# EAGLE design SAMD21_GW_M0-MINI-1591_V04 (EAGLE 8.5.1)
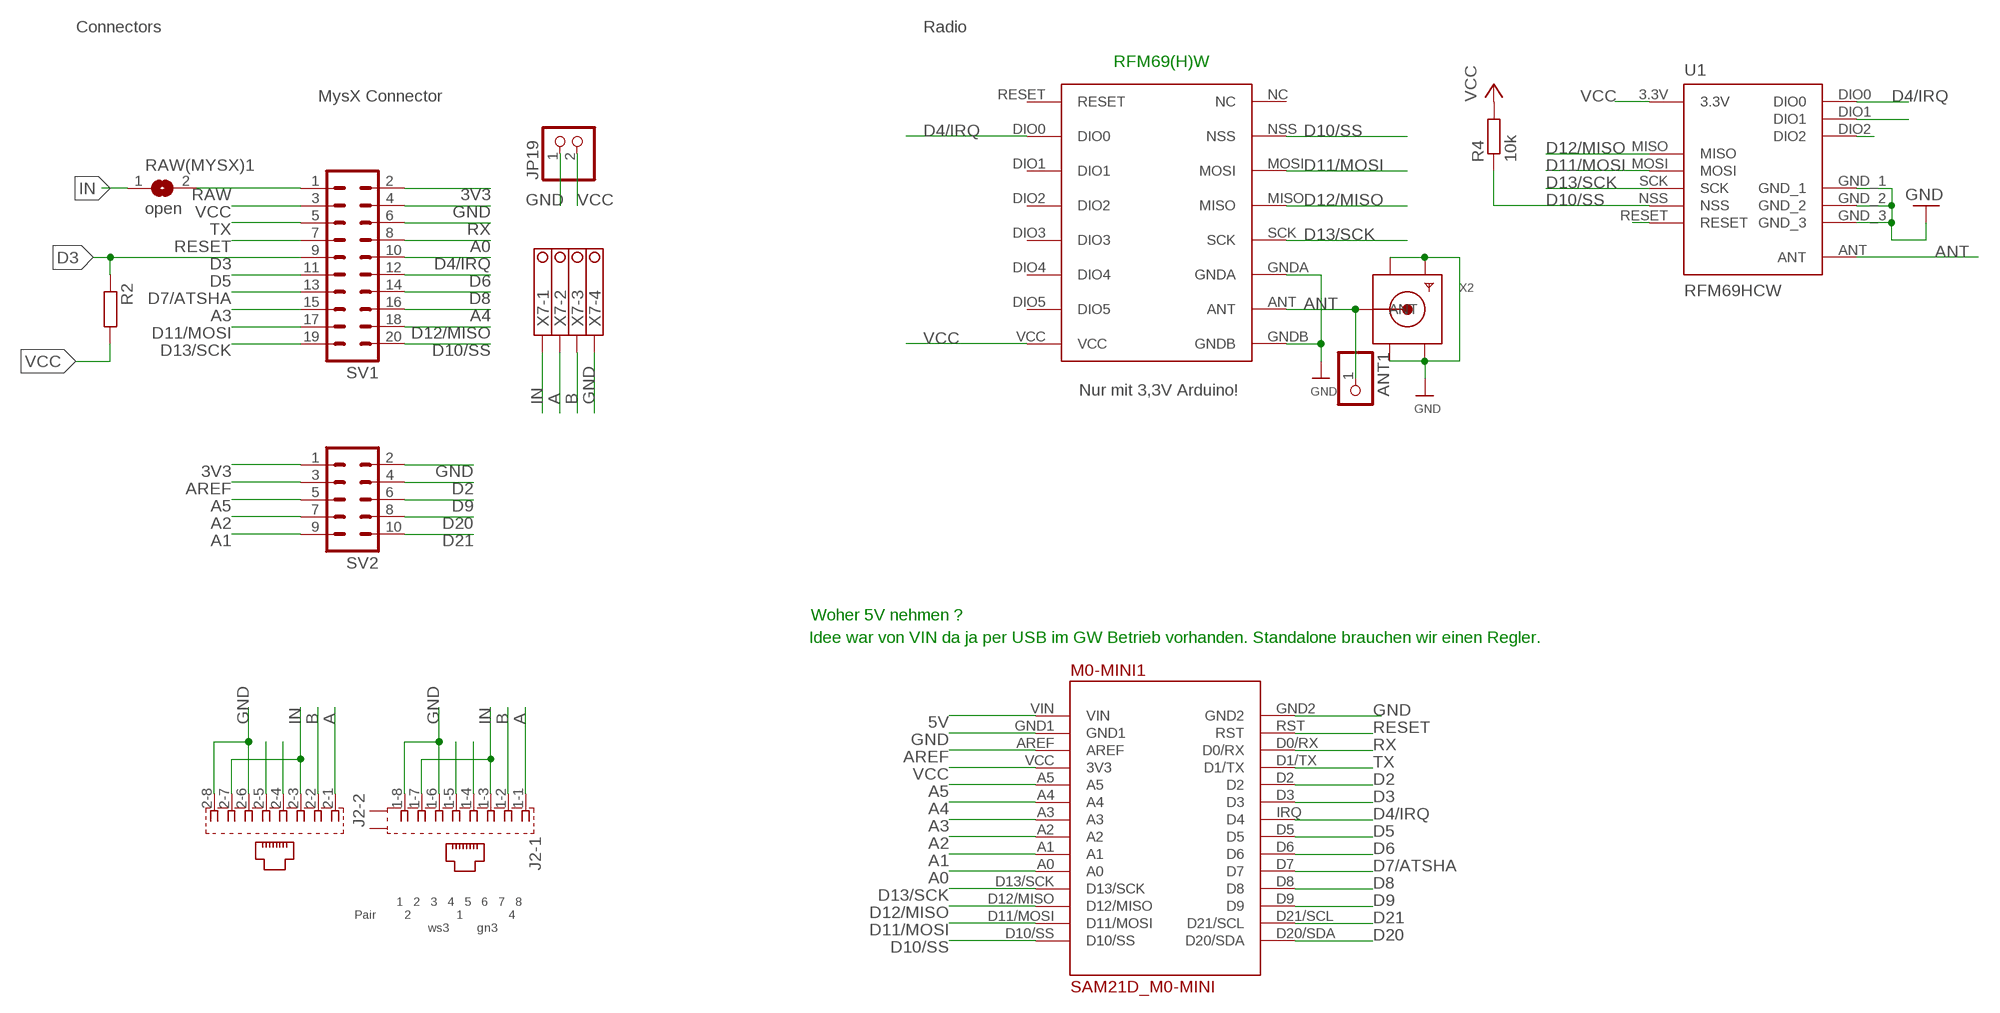
[diagram p0: schematic, sheet 1, part 1 of 2]
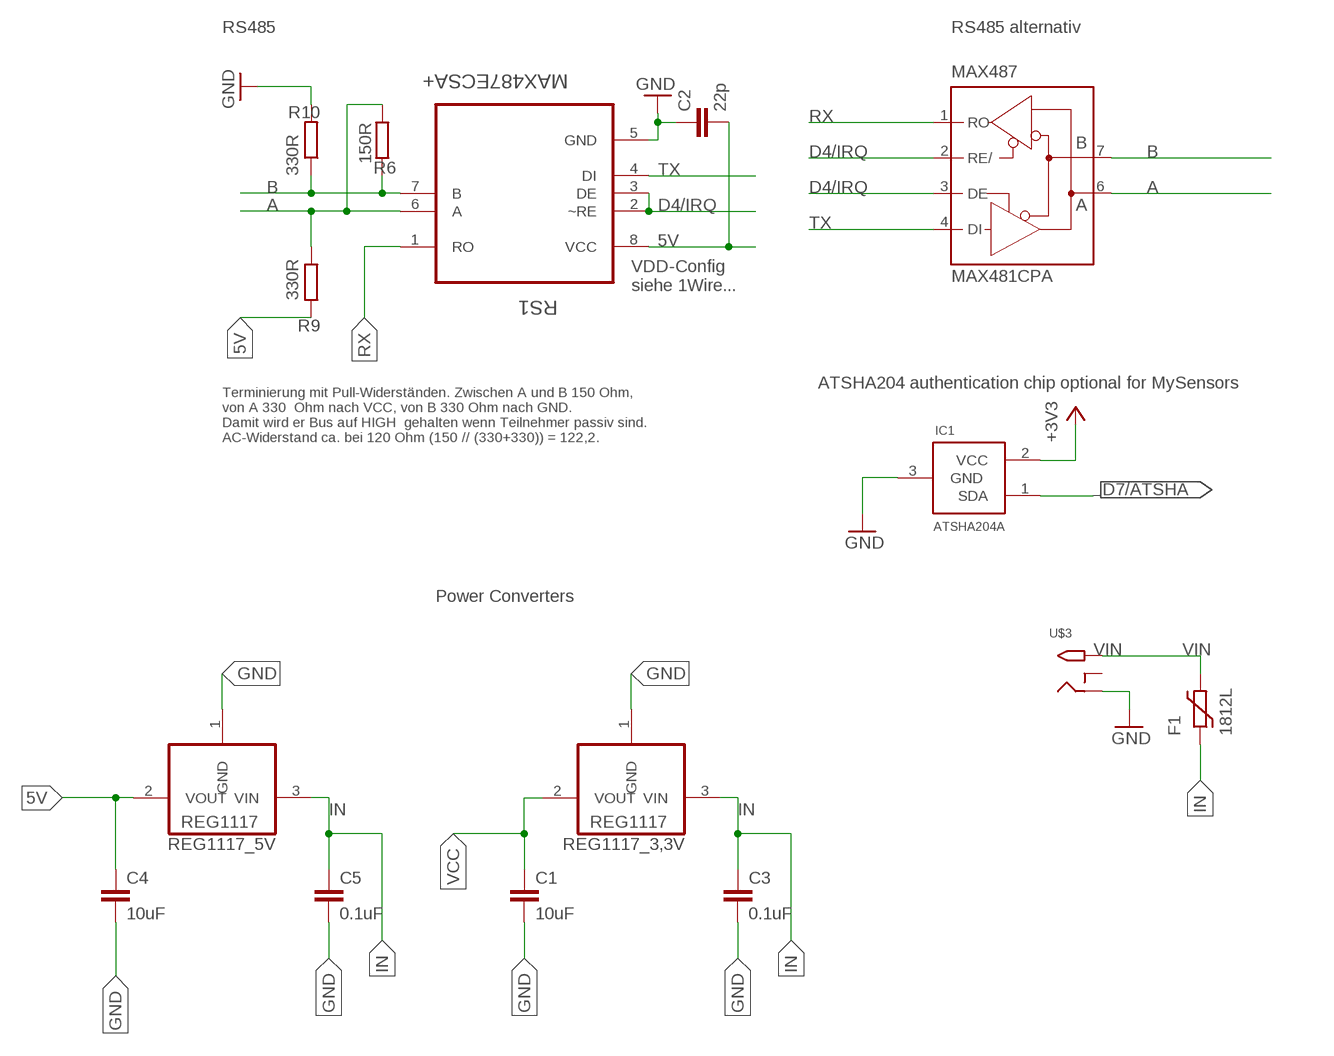
[diagram p1: schematic, sheet 1, part 2 of 2]

## Parts
ANT1  PINHD-1X1  [1X01]
C1  10uF  C-EUC1210  [C1210]
C2  22p  C-EUC0805  [C0805]
C3  0.1uF  C-EUC1206  [C1206]
C4  10uF  C-EUC1210  [C1210]
C5  0.1uF  C-EUC1206  [C1206]
F1  1812L  [1812L]
IC1  ATSHA204A  [SOT23]
J2  557570-1  [557570-1]
JP19  PINHD-1X2  [1X02]
M0-MINI1  SAM21D_M0-MINI  [SAMD21_M0-MINI]
MAX487  MAX481CPA  [DIL08]
R2  R-EU_R0805  [R0805]
R4  10k  R-EU_M0805  [M0805]
R6  150R  R-EU_R0805  [R0805]
R9  330R  R-EU_R0805  [R0805]
R10  330R  R-EU_R0805  [R0805]
RAW(MYSX)1  open  SJ  [SJ]
REG1117_3,3V  REG1117  [SOT223]
REG1117_5V  REG1117  [SOT223]
RFM69W  RFM69HW  [RFM]
RS1  MAX487ECSA+  [SOIC127P600X175-8N]
SV1  MA10-2  [MA10-2]
SV2  MA05-2  [MA05-2]
U1  RFM69HCW  [RFM69HCW-XXXS2]
U$3  2.1MMJACKTHM  [PJ-102A]
X2  SMACONNECTOR_EDGE  [SMA_EDGELAUNCH]
X7  1751264  [1751264]

## Nets
3V3: SV1.2 SV2.1
5V: C2.2 C4.1 M0-MINI1.VIN R9.1 REG1117_5V.2(VOUT) RS1.8(VCC)
A: J2.1-1 J2.2-1 MAX487.6(A) R6.1 R9.2 RS1.6(A) X7.2
A0: M0-MINI1.A0 SV1.8
A1: M0-MINI1.A1 SV2.9
A2: M0-MINI1.A2 SV2.7
A3: M0-MINI1.A3 SV1.15
A4: M0-MINI1.A4 SV1.16
A5: M0-MINI1.A5 SV2.5
ANT: ANT1.1 RFM69W.ANT U1.ANT X2.P(ANT)
AREF: M0-MINI1.AREF SV2.3
B: J2.1-2 J2.2-2 MAX487.7(B) R6.2 R10.1 RS1.7(B) X7.3
D2 [PWR]: M0-MINI1.D2 SV2.4
D3: M0-MINI1.D3 R2.1 SV1.9
D4/IRQ: M0-MINI1.IRQ(D4) RFM69W.DIO0 RS1.2(~RE) RS1.3(DE) SV1.10 U1.DIO0
D5: M0-MINI1.D5 SV1.11
D6: M0-MINI1.D6 SV1.12
D7/ATSHA: IC1.1(SDA) M0-MINI1.D7 SV1.13
D8: M0-MINI1.D8 SV1.14
D9: M0-MINI1.D9 SV2.6
D10/SS: M0-MINI1.D10/SS R4.1 RFM69W.NSS SV1.20 U1.NSS
D11/MOSI: M0-MINI1.D11/MOSI RFM69W.MOSI SV1.17 U1.MOSI
D12/MISO: M0-MINI1.D12/MISO RFM69W.MISO SV1.18 U1.MISO
D13/SCK: M0-MINI1.D13/SCK RFM69W.SCK SV1.19 U1.SCK
D20: SV2.8
D21: SV2.10
GND [PWR]: C1.2 C2.1 C3.2 C4.2 C5.2 IC1.3(GND) J2.1-6 J2.1-8 J2.2-6 J2.2-8 JP19.1 M0-MINI1.GND1 M0-MINI1.GND2 R10.2 REG1117_3,3V.1(GND) REG1117_5V.1(GND) RFM69W.GNDA RFM69W.GNDB RS1.5(GND) SV1.4 SV2.2 U1.GND_1 U1.GND_2 U1.GND_3 U$3.RING X2.GND@1(GND4) X2.GND@2(GND3) X2.GND@3(GND2) X2.GND@4(GND1) X7.4
IN [PWR]: C3.1 C5.1 F1.P$1 J2.1-3 J2.1-7 J2.2-3 J2.2-7 RAW(MYSX)1.1 REG1117_3,3V.3(VIN) REG1117_5V.3(VIN) X7.1
N$1: MAX487.2(RE/)
N$2: J2.1-4
N$3: J2.1-5
N$4: MAX487.3(DE)
N$6: J2.2-4
N$7: J2.2-5
N$10: MAX487.1(RO)
N$11: MAX487.4(DI)
N$12: U1.DIO2
N$13: U1.RESET
N$15: U1.DIO1
RAW: RAW(MYSX)1.2 SV1.1
RESET: M0-MINI1.RST SV1.7
RX: M0-MINI1.D0/RX RS1.1(RO) SV1.6
TX: M0-MINI1.D1/TX RS1.4(DI) SV1.5
VCC [PWR]: C1.1 IC1.2(VCC) JP19.2 M0-MINI1.VCC(3V3) R2.2 R4.2 REG1117_3,3V.2(VOUT) RFM69W.VCC SV1.3 U1.3.3V ; supply symbol labelled +3V3
VIN [PWR]: F1.P$2 U$3.TIP
Unconnected: J2.G1(-1:S2) J2.G3(-1:S1) M0-MINI1.D20/SDA M0-MINI1.D21/SCL RFM69W.DIO1 RFM69W.DIO2 RFM69W.DIO3 RFM69W.DIO4 RFM69W.DIO5 RFM69W.NC RFM69W.RESET U$3.RING_SW

## Notes on the sheet
- Connectors | Radio | RS485 | RS485 alternativ
- RFM69(H)W
- MysX Connector
- VDD-Config
  siehe 1Wire...
- ATSHA204 authentication chip optional for MySensors
- Nur mit 3,3V Arduino!
- Terminierung mit Pull-Widerständen. Zwischen A und B 150 Ohm,
  von A 330  Ohm nach VCC, von B 330 Ohm nach GND. 
  Damit wird er Bus auf HIGH  gehalten wenn Teilnehmer passiv sind.
  AC-Widerstand ca. bei 120 Ohm (150 // (330+330)) = 122,2.
- Power Converters
- Woher 5V nehmen ?
- Idee war von VIN da ja per USB im GW Betrieb vorhanden. Standalone brauchen wir einen Regler.
- 1   2   3   4   5   6   7   8
  Pair        2             1             4
                       ws3        gn3

## Power pins joined to a net without a drawn wire
GND: MAX487.5(GND)
VCC: MAX487.8(VCC)

## Library data of the parts
ANT1 = pinhead:PINHD-1X1: PIN HEADER
C1-C5 = rcl:C-EU: CAPACITOR, European symbol; SPICEPREFIX: C
F1 = ptc-littlefuse:1812L
IC1 = Sensor:ATSHA204A
J2 = con-amp:557570-1: AMP connector
JP19 = pinhead:PINHD-1X2: PIN HEADER
M0-MINI1 = SAM21D_M0-MINI_Footprint:SAM21D_M0-MINI: Footprint SAMD21 M0-MINI
MAX487 = maxim-4:MAX481CPA: RS485 TRANSEIVER
R2 R4 R6 R9 R10 = rcl:R-EU_: RESISTOR, European symbol
RAW(MYSX)1 = jumper:SJ: SMD solder JUMPER
REG1117_3,3V REG1117_5V = burr-brown:REG1117: 800mA and 1A Low Dropout (LDO) Positive Regulator 1.8V, 2.5V, 2.85V, 3.3V, 5V, and Adj; MPN: REG1117; OC_FARNELL: 1097566; OC_NEWARK: 14P6981
RFM69W = hoperf:RFM69HW
RS1 = Maxim_By_element14_Batch_1:MAX487ECSA+: Low-Power, Slew-Rate-Limited RS-485/RS-422 Transceivers; MPN: MAX487ECSA+; OC_FARNELL: 9724532; OC_NEWARK: 68K4803; PACKAGE: SOIC-8; SUPPLIER: Maxim
SV1 = con-lstb:MA10-2: PIN HEADER; OC_FARNELL: unknown; OC_NEWARK: unknown
SV2 = con-lstb:MA05-2: PIN HEADER; OC_FARNELL: unknown; OC_NEWARK: unknown
U1 = doug:RFM69H
U$3 = adafruit:2.1MMJACK: 2.1mm x 5.5mm THM DC jack with internal switch. Digikey part #PJ-102A, 4UCON part #05537 2.1mm x 5.5mm SMT DC jack with internal switch. Digikey part #PJ-002A-SMT, 4UCON part #03267 By microbuilder.eu & adafruit.com
X2 = adafruit:SMACONNECTOR: SMA Connector 90° DIP SMA Connector, 50 Ohm (4UConnector: 07259)
X7 = con-phoenix-350:1751264: MKDS 1/ 4-3,5 Printklemme Nennstrom: 10 A Bemessungsspannung: 160 V Raster: 3,5 mm Polzahl: 4 Montageart: Löten Anschlussart: Schraubanschluss Anschlussrichtung vom Leiter zur Platine: 0° Source: http://eshop.phoenixcontact.com .. 1751264.pdf; MPN: 1751264; OC_FARNELL: unknown; OC_NEWARK: 10R0934

## Net classes
0 default: width 0.254 mm
1 PWR: width 0.406 mm

## Board
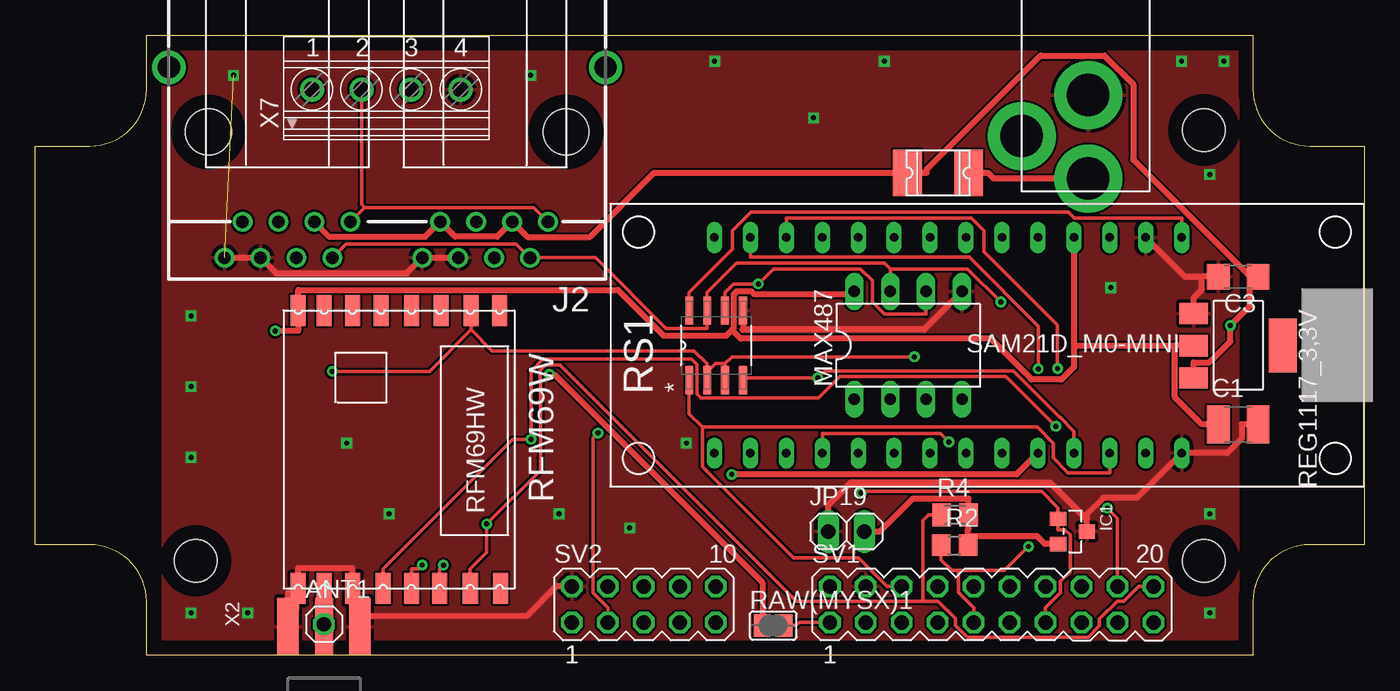
[diagram p2: board, top side]
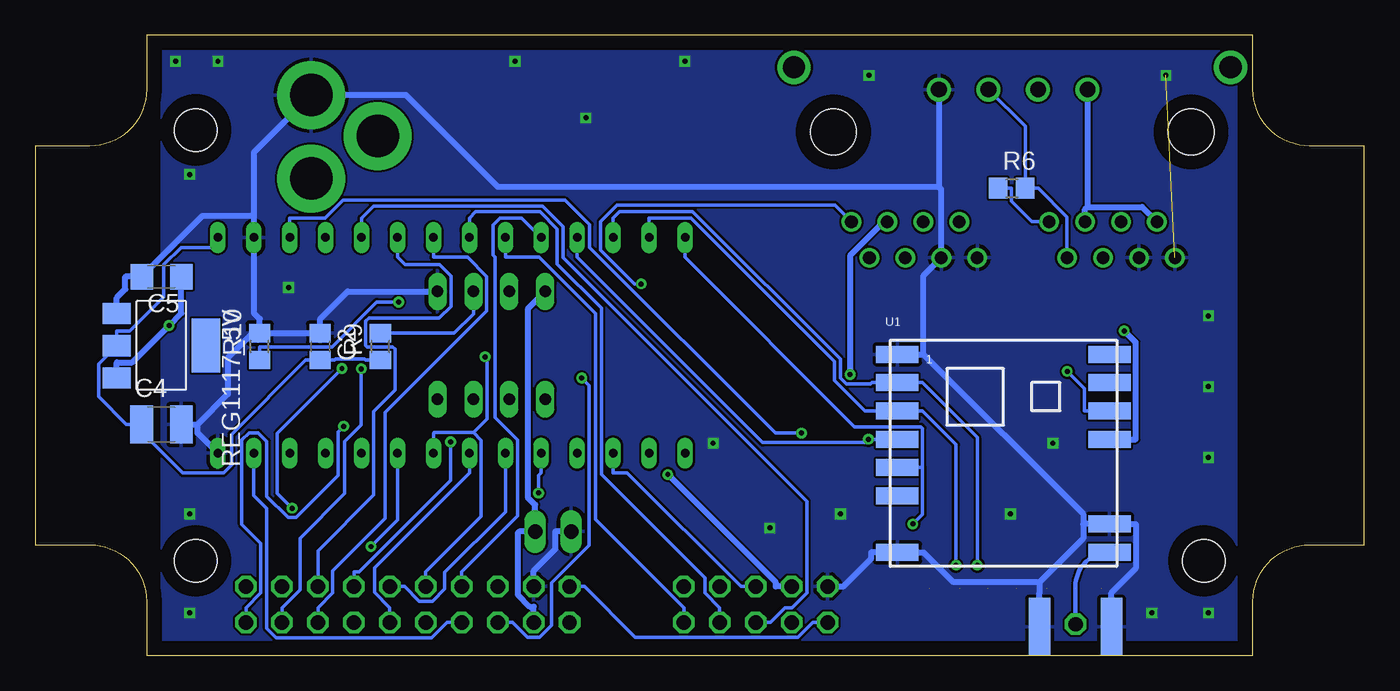
[diagram p3: board, bottom side, seen from below]

Size 93.9 x 43.83 mm. Coordinates in mm from the lower left corner, seen from the top.
Outline: 0,36.02 3.85,36.02 arc90 7.85,40.02 7.85,43.83 86.05,43.83 86.05,40.02 arc90 90.05,36.02 93.9,36.02 93.9,7.82 90.05,7.82 arc90 86.05,3.81 86.05,0 7.85,0 7.85,3.81 arc90 3.85,7.82 0,7.82 0,36.02
Copper layers (1*16): Top 0.035mm / dielectric 1.5mm / Bottom 0.035mm
Design rules "default": minimum track width 6mil, minimum drill 0.35mm, track to track 6mil, track to pad 6mil, pad to pad 6mil, via to via 6mil, smd to smd 6mil, copper to edge 40mil, drill to drill 6mil, minimum pad ring 10mil, minimum via ring 8mil, stop-mask expansion 4mil, vias tented up to drill 0mil, thermal gap 10mil
Holes 3 mm at 11.32,6.69 82.58,6.69 82.58,37.14

### Footprints (pad centres in the part's own frame; a part is rotated, then mirrored left to right if it is on the bottom)
1X01 = drill 1.016 octagon: 1 0,0
C1210 = smd 1.6 x 2.7: 1 -1.4,0; 2 1.4,0
C0805 = smd 1.3 x 1.5: 1 -0.95,0; 2 0.95,0
C1206 = smd 1.6 x 1.8: 1 -1.4,0; 2 1.4,0
1812L = smd 2.03 x 3.3: P$1 -2.16,0; P$2 2.16,0
SOT23 = smd 1.016 x 1.143: 1 -0.889,-1.016; 2 0.889,-1.016; 3 0,1.016
557570-1 = drill 0.889: 1-1 -11.43,6.35; 1-2 -10.16,8.89; 1-3 -8.89,6.35; 1-4 -7.62,8.89; 1-5 -6.35,6.35; 1-6 -5.08,8.89; 1-7 -3.81,6.35; 1-8 -2.54,8.89; 2-1 2.54,6.35; 2-2 3.81,8.89; 2-3 5.08,6.35; 2-4 6.35,8.89; 2-5 7.62,6.35; 2-6 8.89,8.89; 2-7 10.16,6.35; 2-8 11.43,8.89 | drill 1.575 pad 2.184: G1 -15.494,-4.572; G3 15.367,-4.572 | hole 3.251: -12.7,0; 12.573,0
1X02 = drill 1.016 long: 1 -1.27,0; 2 1.27,0
SAMD21_M0-MINI = drill 0.6 long: A0 -7.62,-6.35; A1 -7.62,-3.81; A2 -7.62,-1.27; A3 -7.62,1.27; A4 -7.62,3.81; A5 -7.62,6.35; AREF -7.62,11.43; D0/RX 7.62,11.43; D1/TX 7.62,8.89; D2 7.62,6.35; D3 7.62,3.81; D5 7.62,-1.27; D6 7.62,-3.81; D7 7.62,-6.35; D8 7.62,-8.89; D9 7.62,-11.43; D10/SS -7.62,-16.51; D11/MOSI -7.62,-13.97; D12/MISO -7.62,-11.43; D13/SCK -7.62,-8.89; D20/SDA 7.62,-16.51; D21/SCL 7.62,-13.97; GND1 -7.62,13.97; GND2 7.62,16.51; IRQ 7.62,1.27; RST 7.62,13.97; VCC -7.62,8.89; VIN -7.62,16.51
DIL08 = drill 0.813 long: 1 -3.81,-3.81; 2 -1.27,-3.81; 3 1.27,-3.81; 4 3.81,-3.81; 5 3.81,3.81; 6 1.27,3.81; 7 -1.27,3.81; 8 -3.81,3.81
R0805 = smd 1.3 x 1.5: 1 -0.95,0; 2 0.95,0
M0805 = smd 1.3 x 1.6: 1 -0.95,0; 2 0.95,0
SJ = smd 1.168 x 1.6: 1 -0.762,0; 2 0.762,0
SOT223 = smd 1.499 x 2.007: 1 -2.261,-3.15; 2 0.025,-3.15; 3 2.311,-3.15 | smd 3.81 x 2.007: 4 0,3.15
RFM = smd 2.184 x 1.067: ANT 19.651,2.889; DIO0 0,13.27; DIO1 0,11.143; DIO2 0,9.047; DIO3 0,6.889; DIO4 0,4.889; DIO5 0,2.889; GNDA 19.651,4.889; GNDB 19.651,1.048; MISO 19.651,9.047; MOSI 19.651,11.047; NC 19.651,15.334; NSS 19.651,13.206; RESET 0,15.27; SCK 19.651,7.048; VCC 0,1.048
SOIC127P600X175-8N = smd 1.981 x 0.533: 1 -2.464,1.905; 2 -2.464,0.635; 3 -2.464,-0.635; 4 -2.464,-1.905; 5 2.464,-1.905; 6 2.464,-0.635; 7 2.464,0.635; 8 2.464,1.905
MA10-2 = drill 1.016 octagon: 1 -11.43,-1.27; 2 -11.43,1.27; 3 -8.89,-1.27; 4 -8.89,1.27; 5 -6.35,-1.27; 6 -6.35,1.27; 7 -3.81,-1.27; 8 -3.81,1.27; 9 -1.27,-1.27; 10 -1.27,1.27; 11 1.27,-1.27; 12 1.27,1.27; 13 3.81,-1.27; 14 3.81,1.27; 15 6.35,-1.27; 16 6.35,1.27; 17 8.89,-1.27; 18 8.89,1.27; 19 11.43,-1.27; 20 11.43,1.27
MA05-2 = drill 1.016 octagon: 1 -5.08,-1.27; 2 -5.08,1.27; 3 -2.54,-1.27; 4 -2.54,1.27; 5 0,-1.27; 6 0,1.27; 7 2.54,-1.27; 8 2.54,1.27; 9 5.08,-1.27; 10 5.08,1.27
RFM69HCW-XXXS2 = smd 3 x 1.2: 3.3V 7.5,1; ANT 7.5,-7; DIO0 7.5,3; DIO1 7.5,5; DIO2 7.5,7; GND_1 7.5,-5; GND_2 -7.5,-7; GND_3 -7.5,7; MISO -7.5,5; MOSI -7.5,3; NSS -7.5,-1; RESET -7.5,-3; SCK -7.5,1
PJ-102A = drill 3 pad 4.8: RING 0.1,-3.39; RING_SW -4.6,-6.29; TIP 0.1,-9.29
SMA_EDGELAUNCH = smd 4.064 x 1.524: GND@1 2.032,-2.54; GND@2 2.032,2.54 | smd 4.064 x 1.524 bottom: GND@3 2.032,2.54; GND@4 2.032,-2.54 | smd 4.064 x 1.27: P 2.032,0
1751264 = drill 1.1 pad 1.7: 1 -5.25,-0.1; 2 -1.75,-0.1; 3 1.75,-0.1; 4 5.25,-0.1

### Placement (x,y rotation side)
ANT1  20.4,2.2 0 top
C1  85,16.33 0 top
C2  73.77,21.83 270 bottom
C3  85,26.77 180 top
C4  84.99,16.33 0 bottom
C5  84.98,26.77 180 bottom
F1  63.79,34.11 0 top
IC1  73.29,8.76 270 top
J2  24.8,37 180 top
JP19  57.31,8.76 0 top
M0-MINI1  64.5,21.91 270 top
MAX487  61.68,21.91 0 top
R2  64.96,7.79 0 top
R4  64.99,9.93 0 top
R6  24.9,33.03 0 bottom
R9  69.52,21.83 90 bottom
R10  78.05,21.83 90 bottom
RAW(MYSX)1  52.14,2.11 0 top
REG1117_3,3V  85,21.91 270 top
REG1117_5V  85,21.91 270 bottom
RFM69W  17.53,24.39 270 top
RS1  48.1,21.91 90 top
SV1  67.58,3.6 0 top
SV2  43,3.6 0 top
U1  25.49,14.28 0 bottom
U$3  74.31,43 0 top
X2  20.4,0 90 top
X7  24.8,40.1 0 top

### Tracks (layer width: path | path; a pad name or v marks a point on that pad's centre or on a via)
3V3
  Bottom 0.254: SV1.2 55.11,4.87 51.52,1.28 40.01,1.28 38.96,2.33 SV2.1
5V
  Top 0.254: M0-MINI1.VIN 81.01,30.92 73.41,30.92 72.99,31.34 50.56,31.34 49.26,30.04 49.26,28.71 46.2,25.65 RS1.8
  Bottom 0.254: R9.1 70.55,20.88 70.62,20.95 72.67,20.95 72.74,20.88 C2.2 74.8,20.88 80.05,15.63 80.05,13.46 80.61,12.9 83.5,12.9 86.93,16.33 | 86.93,16.33 87.47,16.33 89.43,18.29 89.43,20.61 REG1117_5V.2 88.15,22.92 87.25,22.92 84.84,25.33 84.84,27.61 83.61,28.84 81.01,28.84 M0-MINI1.VIN | C4.1 86.93,16.33
A  (via drill 0.35 pad 0.76)
  Top 0.254: RS1.6 48.73,25.65 49.34,26.26 v51.09,26.26 52.15,27.32 58.3,27.32 59.14,26.49 59.14,24.99 60,24.12 62.95,24.12 MAX487.6 | 23.28,31.67 35.21,31.67 J2.1-1 | J2.2-1 23.28,31.67 | X7.2 23.05,31.9 23.28,31.67
  Bottom 0.254: MAX487.6 62.95,24.12 64.3,22.78 R9.2 | J2.1-1 37.41,31.83 52.79,31.83 53.95,30.67 53.95,28.66 51.55,26.26 v51.09,26.26 | R6.1 24.92,33.03 24.92,32.1 23.47,30.65 J2.2-1
A0
  Bottom 0.254: SV1.8 63.77,5.91 59.84,9.85 59.84,15.22 61.42,16.81 61.42,28.15 61.56,28.28 61.56,30.42 61.05,30.93 59.54,30.93 M0-MINI1.A0
A1
  Bottom 0.254: M0-MINI1.A1 60.69,28.15 58.29,28.15 54.32,24.17 54.32,9.61 48.08,3.37 SV2.9
A2
  Bottom 0.254: M0-MINI1.A2 63.23,30.92 62.8,31.36 58.23,31.36 57.02,30.15 57.02,27.67 53.9,24.54 53.9,12.79 46.58,5.47 46.58,4.41 45.54,3.37 SV2.7
A3
  Bottom 0.254: M0-MINI1.A3 65.77,28.15 63.37,28.15 62.01,26.79 62.01,24.33 69.17,17.16 69.17,9.68 72.89,5.97 72.89,4.41 73.93,3.37 SV1.15
A4
  Bottom 0.254: SV1.16 73.93,7.41 70,11.33 70,17.25 68.49,18.76 68.49,21.65 68.65,21.81 70.44,21.81 70.55,21.92 70.55,23.62 70.33,23.84 65.36,23.84 64.53,24.67 64.53,26.82 65.33,27.62 67.78,27.62 68.31,28.15 M0-MINI1.A4
A5
  Bottom 0.254: M0-MINI1.A5 70.85,30.92 70,31.77 58.06,31.77 56.61,30.32 56.61,28.11 39.39,10.89 39.39,4.43 40.45,3.37 40.92,3.37 41.96,2.33 SV2.5
ANT  (1 unrouted)
  Top 0.254: RFM69W.ANT 20.42,3.26 20.4,3.24 ANT1.1 X2.P
  Bottom 0.305: U1.ANT arc-90 20.4,4.87 ANT1.1
AREF  (via drill 0.35 pad 0.76)
  Top 0.254: v39.77,15.71 39.41,15.36 39.41,4.42 40.46,3.37 SV2.3
  Bottom 0.254: v39.77,15.71 41.61,15.71 54.74,28.83 54.74,30.46 56.45,32.18 72.15,32.18 73.41,30.92 75.93,30.92 M0-MINI1.AREF
B  (via drill 0.35 pad 0.76)
  Top 0.254: v68.23,24.98 65.88,27.32 60.41,27.32 | 60.41,27.32 59.99,27.74 49.56,27.74 47.47,25.65 RS1.7 47.47,23.74 47.47,23.11 44.58,23.11 39.57,28.11 J2.1-2 33.98,29.09 21.97,29.09 J2.2-2 | MAX487.7 60.41,27.32
  Bottom 0.254: v68.23,24.98 69.77,24.98 72.94,21.81 78.05,21.81 R10.1 | J2.2-2 20.99,31 23.02,33.03 R6.2 23.95,37.4 X7.3
D2  (via drill 0.35 pad 0.76)
  Top 0.406: M0-MINI1.D2 69.34,12.78 v49.21,12.78
  Bottom 0.406: v49.21,12.78 41.58,5.15 41.58,4.87 SV2.4
D3  (via drill 0.35 pad 0.76)
  Top 0.254: 65.21,5.99 68.49,5.99 v70.18,7.69 | 65.21,5.99 64.78,5.99 64.01,6.76 R2.1 | 65.21,5.99 65.21,4.47 66.31,3.37 SV1.9
  Bottom 0.254: M0-MINI1.D3 68.31,12.91 68.31,9.56 v70.18,7.69
D4/IRQ  (via drill 0.35 pad 0.76)
  Top 0.254: 30.8,23.02 32.28,21.53 46.55,21.53 47.47,20.62 47.47,20.04 | 48.73,20.62 49.22,21.1 v62.11,21.1 | 47.47,20.04 48.05,20.62 48.73,20.62 | RS1.3 48.73,20.62 | RS1.2 47.47,20.04 | RFM69W.DIO0 30.8,23.02 | v20.99,20.08 27.86,20.08 30.8,23.02
  Bottom 0.254: 62.94,15.74 62.39,15.2 62.39,9.83 66.31,5.91 SV1.10 | 62.94,15.74 65.71,15.74 65.77,15.68 M0-MINI1.IRQ | 62.94,15.74 61.97,16.71 61.97,20.96 v62.11,21.1 | U1.DIO0 19.77,17.28 19.77,18.86 v20.99,20.08
D5
  Bottom 0.254: M0-MINI1.D5 63.23,12.91 69.94,6.19 69.94,4.46 68.85,3.37 SV1.11
D6
  Bottom 0.254: SV1.12 67.81,4.87 66.77,3.83 65.84,3.83 64.97,4.7 64.97,5.88 60.69,10.16 M0-MINI1.D6
D7/ATSHA  (via drill 0.35 pad 0.76)
  Top 0.254: SV1.13 71.39,3.37 72.43,4.41 72.43,5.22 73.12,5.91 73.12,8.5 72.77,8.86 72.27,8.86 IC1.1 72.27,10.44 71.12,11.59 58.46,11.59 v58.35,11.47
  Bottom 0.254: M0-MINI1.D7 58.15,12.91 58.35,12.71 v58.35,11.47
D8  (via drill 0.35 pad 0.76)
  Top 0.254: M0-MINI1.D8 55.61,15.68 63.96,15.68 v64.55,15.09
  Bottom 0.254: SV1.14 71.39,5.91 71.02,5.91 64.55,12.37 v64.55,15.09
D9
  Bottom 0.254: M0-MINI1.D9 53.07,12.91 52.08,12.91 44.04,4.87 SV2.6
D10/SS  (via drill 0.35 pad 0.76)  (1 unrouted)
  Top 0.254: 62.71,3.83 53.77,3.83 37.07,20.52 36.05,20.52 35.66,20.14 35.66,19.56 35.7,19.52 35.7,13.09 v31.89,9.28 31.89,7.27 30.74,6.11 RFM69W.NSS | 62.71,3.83 63.79,3.83 65.01,2.61 65.01,2.13 65.85,1.28 74.4,1.28 75.2,2.09 75.2,2.57 76.46,3.83 76.93,3.83 77.97,4.87 SV1.20 | 62.71,3.83 62.71,9.53 63.11,9.93 R4.1
  Bottom 0.254: 31.21,13.28 31.21,9.96 v31.89,9.28 | 31.21,13.28 31.31,13.28 U1.NSS | 31.21,13.28 31.21,16.06 31.31,16.16 36,16.16 47.99,28.15 M0-MINI1.D10/SS
D11/MOSI  (via drill 0.35 pad 0.76)  (1 unrouted)
  Top 0.254: M0-MINI1.D11/MOSI 50.53,28.15 65.99,28.15 70.87,23.26 v70.87,20.25 | v28.84,6.37 28.58,6.11 RFM69W.MOSI
  Bottom 0.254: SV1.17 76.47,3.37 75.2,4.64 75.2,8.28 72.04,11.44 72.04,15.12 70.87,16.29 v70.87,20.25 | v28.84,6.37 28.84,14.91 31.21,17.28 32.1,17.28 U1.MOSI 34.77,17.28 35.27,17.28 37.42,19.43 37.42,20.77 47.58,30.92 50.53,30.92 M0-MINI1.D11/MOSI
D12/MISO  (via drill 0.35 pad 0.76)  (1 unrouted)
  Top 0.254: v75.76,10.4 76.47,9.69 76.47,5.91 SV1.18 | v72.24,20.28 72.24,23.34 67.04,28.54 67.04,30.04 66.16,30.92 53.07,30.92 M0-MINI1.D12/MISO | v27.34,6.38 27.07,6.11 26.58,6.11 RFM69W.MISO
  Bottom 0.254: v72.24,20.28 76.81,15.71 76.81,11.46 v75.76,10.4 | M0-MINI1.D12/MISO 53.07,30.92 52.61,31.38 47.46,31.38 37.02,20.94 37.02,19.6 36.59,19.17 34.88,19.17 34.77,19.28 U1.MISO 31.21,19.28 27.34,15.41 v27.34,6.38
D13/SCK  (via drill 0.35 pad 0.76)  (1 unrouted)
  Top 0.254: v72.11,16.2 68.6,19.7 56.86,19.7 55.33,18.18 47.03,18.18 46.74,18.47 46.74,20.56 46.36,20.94 35.89,20.94 35.02,20.08 v35.02,15.27 33.74,15.27 24.58,6.11 RFM69W.SCK
  Bottom 0.254: 72.52,15.79 72.52,12.71 75.48,9.74 76.04,9.74 77.55,11.25 77.55,15.13 78.15,15.73 78.8,15.73 79.32,15.21 79.32,9.26 77.97,7.91 77.97,4.41 79.01,3.37 SV1.19 | 72.52,15.79 | 72.52,15.79 v72.11,16.2 | U1.SCK 35.02,15.28 v35.02,15.27 35.25,15.05 42.51,15.05 55.61,28.15 M0-MINI1.D13/SCK
GND  (via drill 0.35)  (3 unrouted)
  Top 0.406: 74.31,9.62 74.31,9.99 75.46,11.13 77.85,11.13 M0-MINI1.GND2 84.22,14.29 85.24,15.32 85.24,16.33 C1.2 | JP19.1 56.04,10.64 57.62,12.22 71.71,12.22 74.31,9.62 | IC1.3 74.31,9.62 | RS1.5 50.01,23.03 62.8,23.03 MAX487.5 | J2.2-8 J2.2-6 17.01,27.01 26.24,27.01 J2.1-8 J2.1-6 | SV2.2 36.8,4.87 34.73,2.8 22.94,2.8 | 22.94,2.8 22.45,3.29 22.42,3.29 RFM69W.GNDA 22.42,6.19 18.58,6.19 RFM69W.GNDB 18.26,4.42 17.86,4.42 X2.GND@2 | M0-MINI1.GND1 81.23,26.77 82.44,26.77 | C3.2 82.44,26.77 | REG1117_3,3V.1 81.85,25.28 82.44,25.88 82.44,26.77 | X2.GND@1 22.94,2.8
  Bottom 0.406: 78.47,31.05 M0-MINI1.GND1 78.47,24.21 78.05,23.79 78.05,23.28 | 78.47,31.05 78.47,35.55 U$3.RING 67.71,39.61 61.21,33.11 30.05,33.11 | 78.47,31.05 82.1,31.05 C5.2 87.54,26.77 87.54,25.89 88.15,25.28 REG1117_5V.1 | MAX487.5 71.83,25.73 73.77,23.79 C2.1 R10.2 78.05,23.28 | 30.05,33.11 29.88,32.94 J2.1-6 31.13,26.86 31.13,21.28 | X7.4 30.05,33.11 | 22.94,5.17 29.02,5.17 31.13,7.28 U1.GND_2 34.85,7.28 34.85,6.83 36.8,4.87 SV2.2 | 19.85,9.28 19.85,8.26 22.94,5.17 | 22.94,5.17 22.94,4.42 X2.GND@1 | 31.13,21.28 19.85,9.99 19.85,9.28 | 19.85,9.28 U1.GND_1 16.13,9.28 16.13,6.14 17.86,4.42 X2.GND@2 | 78.05,23.28 80.3,21.04 80.3,18.47 82.43,16.33 | C4.2 82.43,16.33 | M0-MINI1.GND2 82.43,15.72 82.43,16.33 | JP19.1 57.16,8.76 57.16,7.52 58.69,5.99 SV1.4 | U1.GND_3 31.13,21.28
  other vias: 14,41 11,24 11,19 11,14 11,3 15,3 37,10 25,10 35,41 48,42 60,42 84,42 81,42 83,34 76,26 83,10 83,3 42,9 46,15 22,15 55,38
  pour Bottom: 9,43 85,43 85,1 9,1
  pour Top: 9,1 9,43 85,43 85,1
IN  (via drill 0.35 pad 0.76)
  Top 0.406: v36.32,19.85 36.7,19.85 51.38,5.17 RAW(MYSX)1.1 | 85.85,26.77 77.58,35.04 77.58,40.38 75.55,42.4 71.04,42.4 63,34.37 63,34.11 F1.P$1 43.72,34.11 39.18,29.57 34.77,29.57 J2.1-3 32.64,29.6 29.66,29.6 J2.1-7 27.56,29.6 20.77,29.6 J2.2-3 | 85.85,26.77 85.82,26.77 85.82,24.69 v84.45,23.32 84.45,22.2 82.95,20.71 81.85,20.71 REG1117_3,3V.3 | C3.1 85.85,26.77
  Bottom 0.406: J2.1-3 33.93,30.65 36.32,28.25 v36.32,19.85 | C5.1 83.58,24.19 v84.45,23.32 87.06,20.71 88.15,20.71 REG1117_5V.3 | 19.55,31.71 15.7,31.71 J2.2-7 | J2.2-3 19.72,31.54 19.55,31.71 | X7.1 19.55,31.71
RAW
  Top 0.254: RAW(MYSX)1.2 53.77,2.11 53.99,2.33 SV1.1
RESET
  Bottom 0.254: SV1.7 64.81,2.33 65.9,1.24 76.89,1.24 77.55,1.9 77.55,10.39 78.47,11.32 M0-MINI1.RST
RX
  Top 0.254: 47.13,16.13 70.8,16.13 71.94,14.99 71.94,13.95 72.98,12.91 75.93,12.91 M0-MINI1.D0/RX | 47.13,16.13 46.2,17.07 46.2,18.5 RS1.1 | 47.13,16.13 47.13,13.34 53.56,6.91 58.15,6.91 60.19,4.87 SV1.6
TX  (via drill 0.35 pad 0.76)
  Top 0.254: RS1.4 50.16,19.61 v55.29,19.61 55.79,20.11 69.11,20.11 72.37,16.85 72.38,16.85 73.39,15.85 73.39,15.68 M0-MINI1.D1/TX
  Bottom 0.254: v55.29,19.61 54.77,19.09 54.77,7.79 57.42,5.14 57.42,2.12 58.27,1.27 59.13,1.27 60.19,2.33 SV1.5
VCC  (via drill 0.35 pad 0.76)
  Top 0.406: 49.22,23 49.36,23.14 49.36,25.52 49.58,25.74 50.57,25.74 50.78,25.53 57.67,25.53 MAX487.8 | JP19.2 59.7,8.76 62.02,11.09 65.94,11.09 R4.2 65.94,8.93 65.91,8.9 65.91,8.34 | C1.1 82.44,16.33 80.49,18.28 80.49,21.89 | 73.39,21.89 80.49,21.89 | 73.39,21.89 73.39,20.39 72.5,19.5 70.42,19.5 67.53,22.39 49.83,22.39 49.22,23 | M0-MINI1.VCC 73.39,21.89 | REG1117_3,3V.2 80.49,21.89 | 49.22,23 48.83,22.61 44.39,22.61 41.16,25.84 18.58,25.84 RFM69W.VCC 18.58,22.94 v16.96,22.94 | 65.91,8.34 65.99,8.42 70.8,8.42 71.35,7.87 IC1.2 | R2.2 65.91,8.34
  Bottom 0.406: MAX487.8 59.12,24.48 59.12,11.18 58.58,10.64 JP19.2 59.7,8.76 59.82,8.63 59.82,4.31 58.96,3.45 58.69,3.45 SV1.3 | v16.96,22.94 16.13,22.12 16.13,15.28 U1.3.3V
VIN
  Top 0.406: F1.P$2 67.32,34.11 67.72,33.71 U$3.TIP